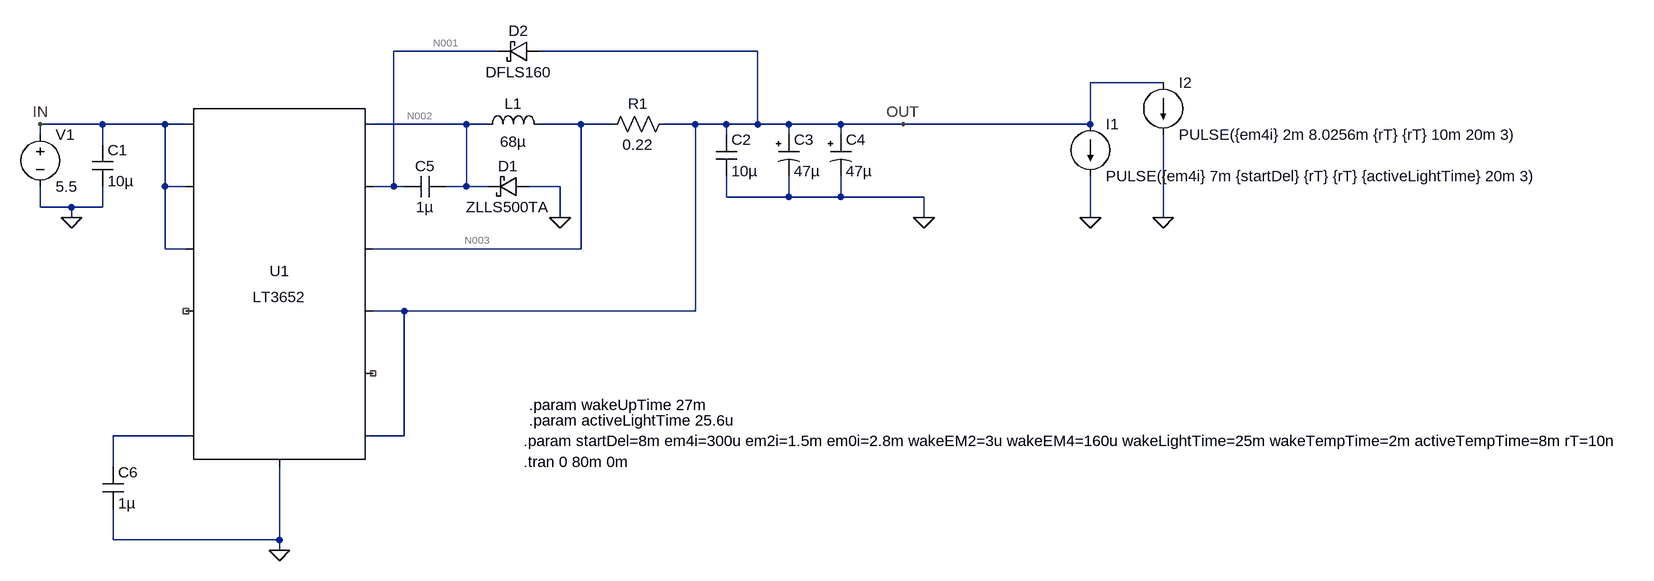
[diagram p0: schematic 3652_PowerCircuit.asc]
3652_PowerCircuit.asc, the LTspice schematic file:
Version 4
SHEET 1 3224 680
WIRE 560 -176 400 -176
WIRE 960 -176 624 -176
WIRE 1584 -128 1472 -128
WIRE -48 -64 -144 -64
WIRE 48 -64 -48 -64
WIRE 80 -64 48 -64
WIRE 512 -64 368 -64
WIRE 544 -64 512 -64
WIRE 688 -64 624 -64
WIRE 736 -64 688 -64
WIRE 864 -64 816 -64
WIRE 912 -64 864 -64
WIRE 960 -64 960 -176
WIRE 960 -64 912 -64
WIRE 1008 -64 960 -64
WIRE 1088 -64 1008 -64
WIRE 1184 -64 1088 -64
WIRE 1472 -64 1472 -128
WIRE 1472 -64 1184 -64
WIRE -144 -48 -144 -64
WIRE 912 -48 912 -64
WIRE 1008 -48 1008 -64
WIRE 1088 -48 1088 -64
WIRE -48 -32 -48 -64
WIRE 48 32 48 -64
WIRE 80 32 48 32
WIRE 400 32 400 -176
WIRE 400 32 368 32
WIRE 416 32 400 32
WIRE 512 32 512 -64
WIRE 512 32 480 32
WIRE 544 32 512 32
WIRE 656 32 608 32
WIRE 912 48 912 16
WIRE 1008 48 1008 16
WIRE 1008 48 912 48
WIRE 1088 48 1088 16
WIRE 1088 48 1008 48
WIRE 1216 48 1088 48
WIRE -144 64 -144 32
WIRE -96 64 -144 64
WIRE -48 64 -48 32
WIRE -48 64 -96 64
WIRE -96 80 -96 64
WIRE 656 80 656 32
WIRE 1216 80 1216 48
WIRE 1472 80 1472 16
WIRE 1584 80 1584 -48
WIRE 48 128 48 32
WIRE 80 128 48 128
WIRE 688 128 688 -64
WIRE 688 128 368 128
WIRE 416 224 368 224
WIRE 864 224 864 -64
WIRE 864 224 416 224
WIRE 80 416 -32 416
WIRE 416 416 416 224
WIRE 416 416 368 416
WIRE -32 464 -32 416
WIRE -32 576 -32 528
WIRE 224 576 224 464
WIRE 224 576 -32 576
WIRE 224 592 224 576
FLAG 224 592 0
FLAG 1216 80 0
FLAG -144 -64 IN
FLAG 656 80 0
FLAG -96 80 0
FLAG 1184 -64 OUT
FLAG 1472 80 0
FLAG 1584 80 0
SYMBOL PowerProducts\\LT3652 224 176 R0
SYMATTR InstName U1
SYMBOL voltage -144 -64 R0
WINDOW 123 0 0 Left 0
WINDOW 39 0 0 Left 0
SYMATTR InstName V1
SYMATTR Value 5.5
SYMBOL ind 528 -48 R270
WINDOW 0 32 56 VTop 2
WINDOW 3 5 56 VBottom 2
SYMATTR InstName L1
SYMATTR Value 68µ
SYMATTR SpiceLine Rpar=10K
SYMBOL res 720 -48 R270
WINDOW 0 32 56 VTop 2
WINDOW 3 0 56 VBottom 2
SYMATTR InstName R1
SYMATTR Value 0.22
SYMBOL cap 896 -48 R0
SYMATTR InstName C2
SYMATTR Value 10µ
SYMBOL cap 480 16 R90
WINDOW 0 0 32 VBottom 2
WINDOW 3 32 32 VTop 2
SYMATTR InstName C5
SYMATTR Value 1µ
SYMBOL cap -64 -32 R0
SYMATTR InstName C1
SYMATTR Value 10µ
SYMBOL cap -48 464 R0
SYMATTR InstName C6
SYMATTR Value 1µ
SYMBOL schottky 608 16 R90
WINDOW 0 0 32 VBottom 2
WINDOW 3 32 32 VTop 2
SYMATTR InstName D1
SYMATTR Value ZLLS500TA
SYMATTR Description Diode
SYMATTR Type diode
SYMBOL schottky 624 -192 R90
WINDOW 0 0 32 VBottom 2
WINDOW 3 32 32 VTop 2
SYMATTR InstName D2
SYMATTR Value DFLS160
SYMATTR Description Diode
SYMATTR Type diode
SYMBOL polcap 992 -48 R0
WINDOW 3 24 56 Left 2
SYMATTR Value 47µ
SYMATTR InstName C3
SYMATTR Description Capacitor
SYMATTR Type cap
SYMATTR SpiceLine V=20 Irms=2 Rser=0.045 Lser=0 mfg="KEMET" pn="T521W476M020ATE045" type="Tantalum"
SYMBOL polcap 1072 -48 R0
WINDOW 3 24 56 Left 2
SYMATTR Value 47µ
SYMATTR InstName C4
SYMATTR Description Capacitor
SYMATTR Type cap
SYMATTR SpiceLine V=20 Irms=2 Rser=0.045 Lser=0 mfg="KEMET" pn="T521W476M020ATE045" type="Tantalum"
SYMBOL current 1472 -64 R0
WINDOW 123 0 0 Left 0
WINDOW 39 0 0 Left 0
SYMATTR InstName I1
SYMATTR Value PULSE({em4i} 7m {startDel} {rT} {rT} {activeLightTime} 20m 3)
SYMBOL current 1584 -128 R0
WINDOW 123 0 0 Left 0
WINDOW 39 0 0 Left 0
SYMATTR InstName I2
SYMATTR Value PULSE({em4i} 2m 8.0256m {rT} {rT} 10m 20m 3)
TEXT 600 456 Left 2 !.tran 0 80m 0m
TEXT 600 424 Left 2 !.param startDel=8m em4i=300u em2i=1.5m em0i=2.8m wakeEM2=3u wakeEM4=160u wakeLightTime=25m wakeTempTime=2m activeTempTime=8m rT=10n
TEXT 608 368 Left 2 !.param wakeUpTime 27m
TEXT 608 392 Left 2 !.param activeLightTime 25.6u

The netlist it stands for:
* 3652_PowerCircuit.asc
XU1 IN IN IN NC_01 NC_02 N004 OUT NC_03 OUT N003 N001 N002 0 LT3652
V1 IN 0 5.5
L1 N002 N003 68µ Rpar=10K
R1 N003 OUT 0.22
C2 OUT 0 10µ
C5 N002 N001 1µ
C1 IN 0 10µ
C6 N004 0 1µ
D1 0 N002 ZLLS500TA
D2 OUT N001 DFLS160
C3 OUT 0 47µ V=20 Irms=2 Rser=0.045 Lser=0 mfg="KEMET" pn="T521W476M020ATE045" type="Tantalum"
C4 OUT 0 47µ V=20 Irms=2 Rser=0.045 Lser=0 mfg="KEMET" pn="T521W476M020ATE045" type="Tantalum"
I1 OUT 0 PULSE({em4i} 7m {startDel} {rT} {rT} {activeLightTime} 20m 3)
I2 OUT 0 PULSE({em4i} 2m 8.0256m {rT} {rT} 10m 20m 3)
.model D D
.lib standard.dio
.tran 0 80m 0m
.param startDel=8m em4i=300u em2i=1.5m em0i=2.8m wakeEM2=3u wakeEM4=160u wakeLightTime=25m wakeTempTime=2m activeTempTime=8m rT=10n
.param wakeUpTime 27m
.param activeLightTime 25.6u
.lib LT3652.sub
.backanno
.end

* Results of the author's LTspice run, read from the files saved beside the schematic
* Operating Point, zero values left out:
*   V(in) = 5.5 V
*   V(out) = -186.6 mV
*   V(n003) = -182.1 mV
*   V(n001) = -454.6 mV
*   V(n002) = -182.1 mV
*   I(D2) = 20 mA
*   I(D1) = 603 µA
*   I(L1) = 20.6 mA
*   I(I2) = 300 µA
*   I(I1) = 300 µA
*   I(R1) = 20.6 mA
*   I(V1) = -65.66 µA
*   Ix(u1:1) = 65.66 µA
*   Ix(u1:7) = 110 nA
*   Ix(u1:9) = -177.9 pA
*   Ix(u1:10) = 3 µA
*   Ix(u1:11) = 20 mA
*   Ix(u1:12) = -20 mA
*   Ix(u1:13) = -68.61 µA